# EAGLE schematic Column_PCB_Schematic (EAGLE 7.5.0), part 1 of 3
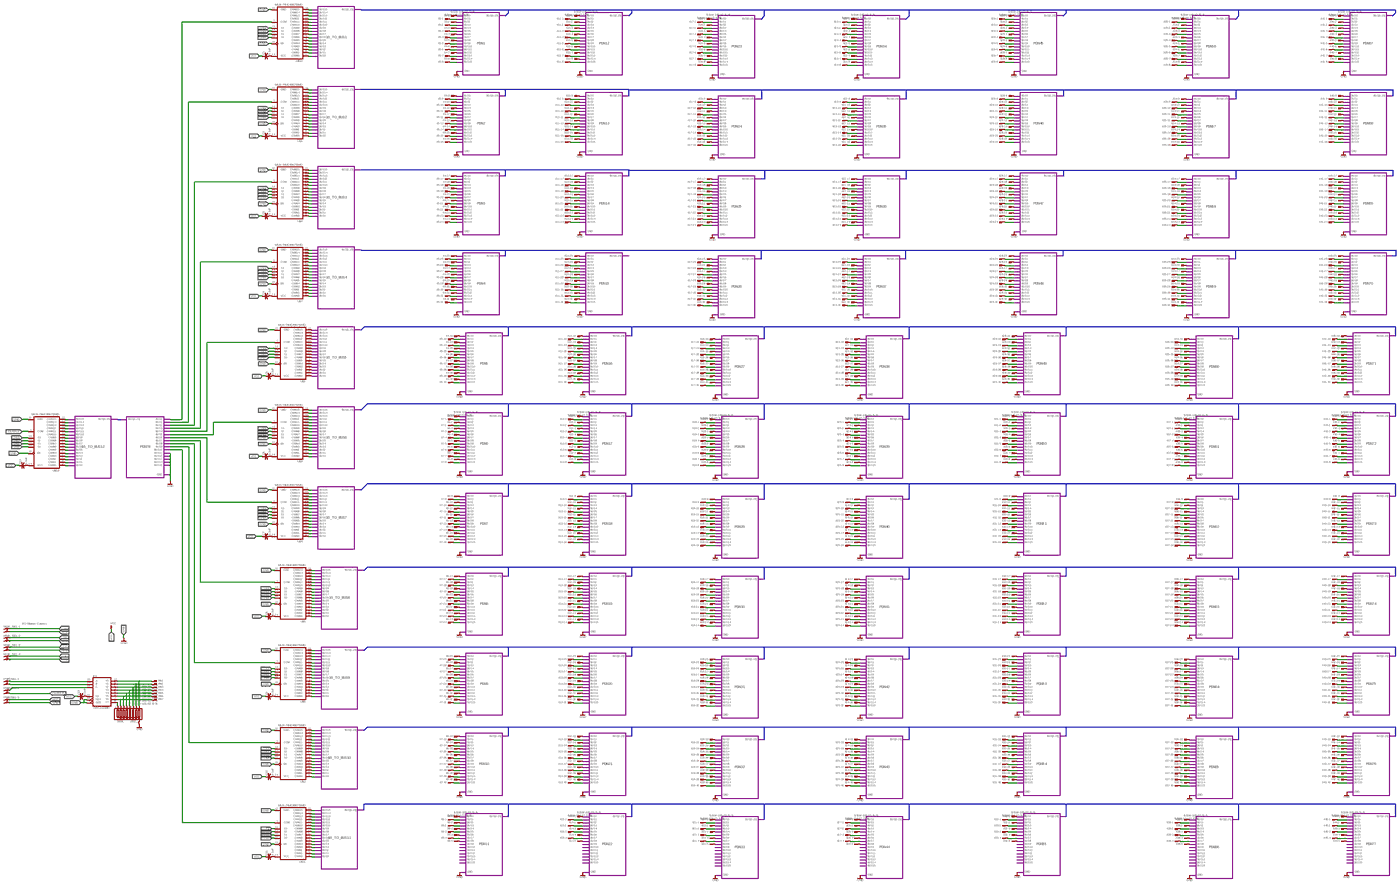
[diagram p0: schematic, sheet 1, overview]
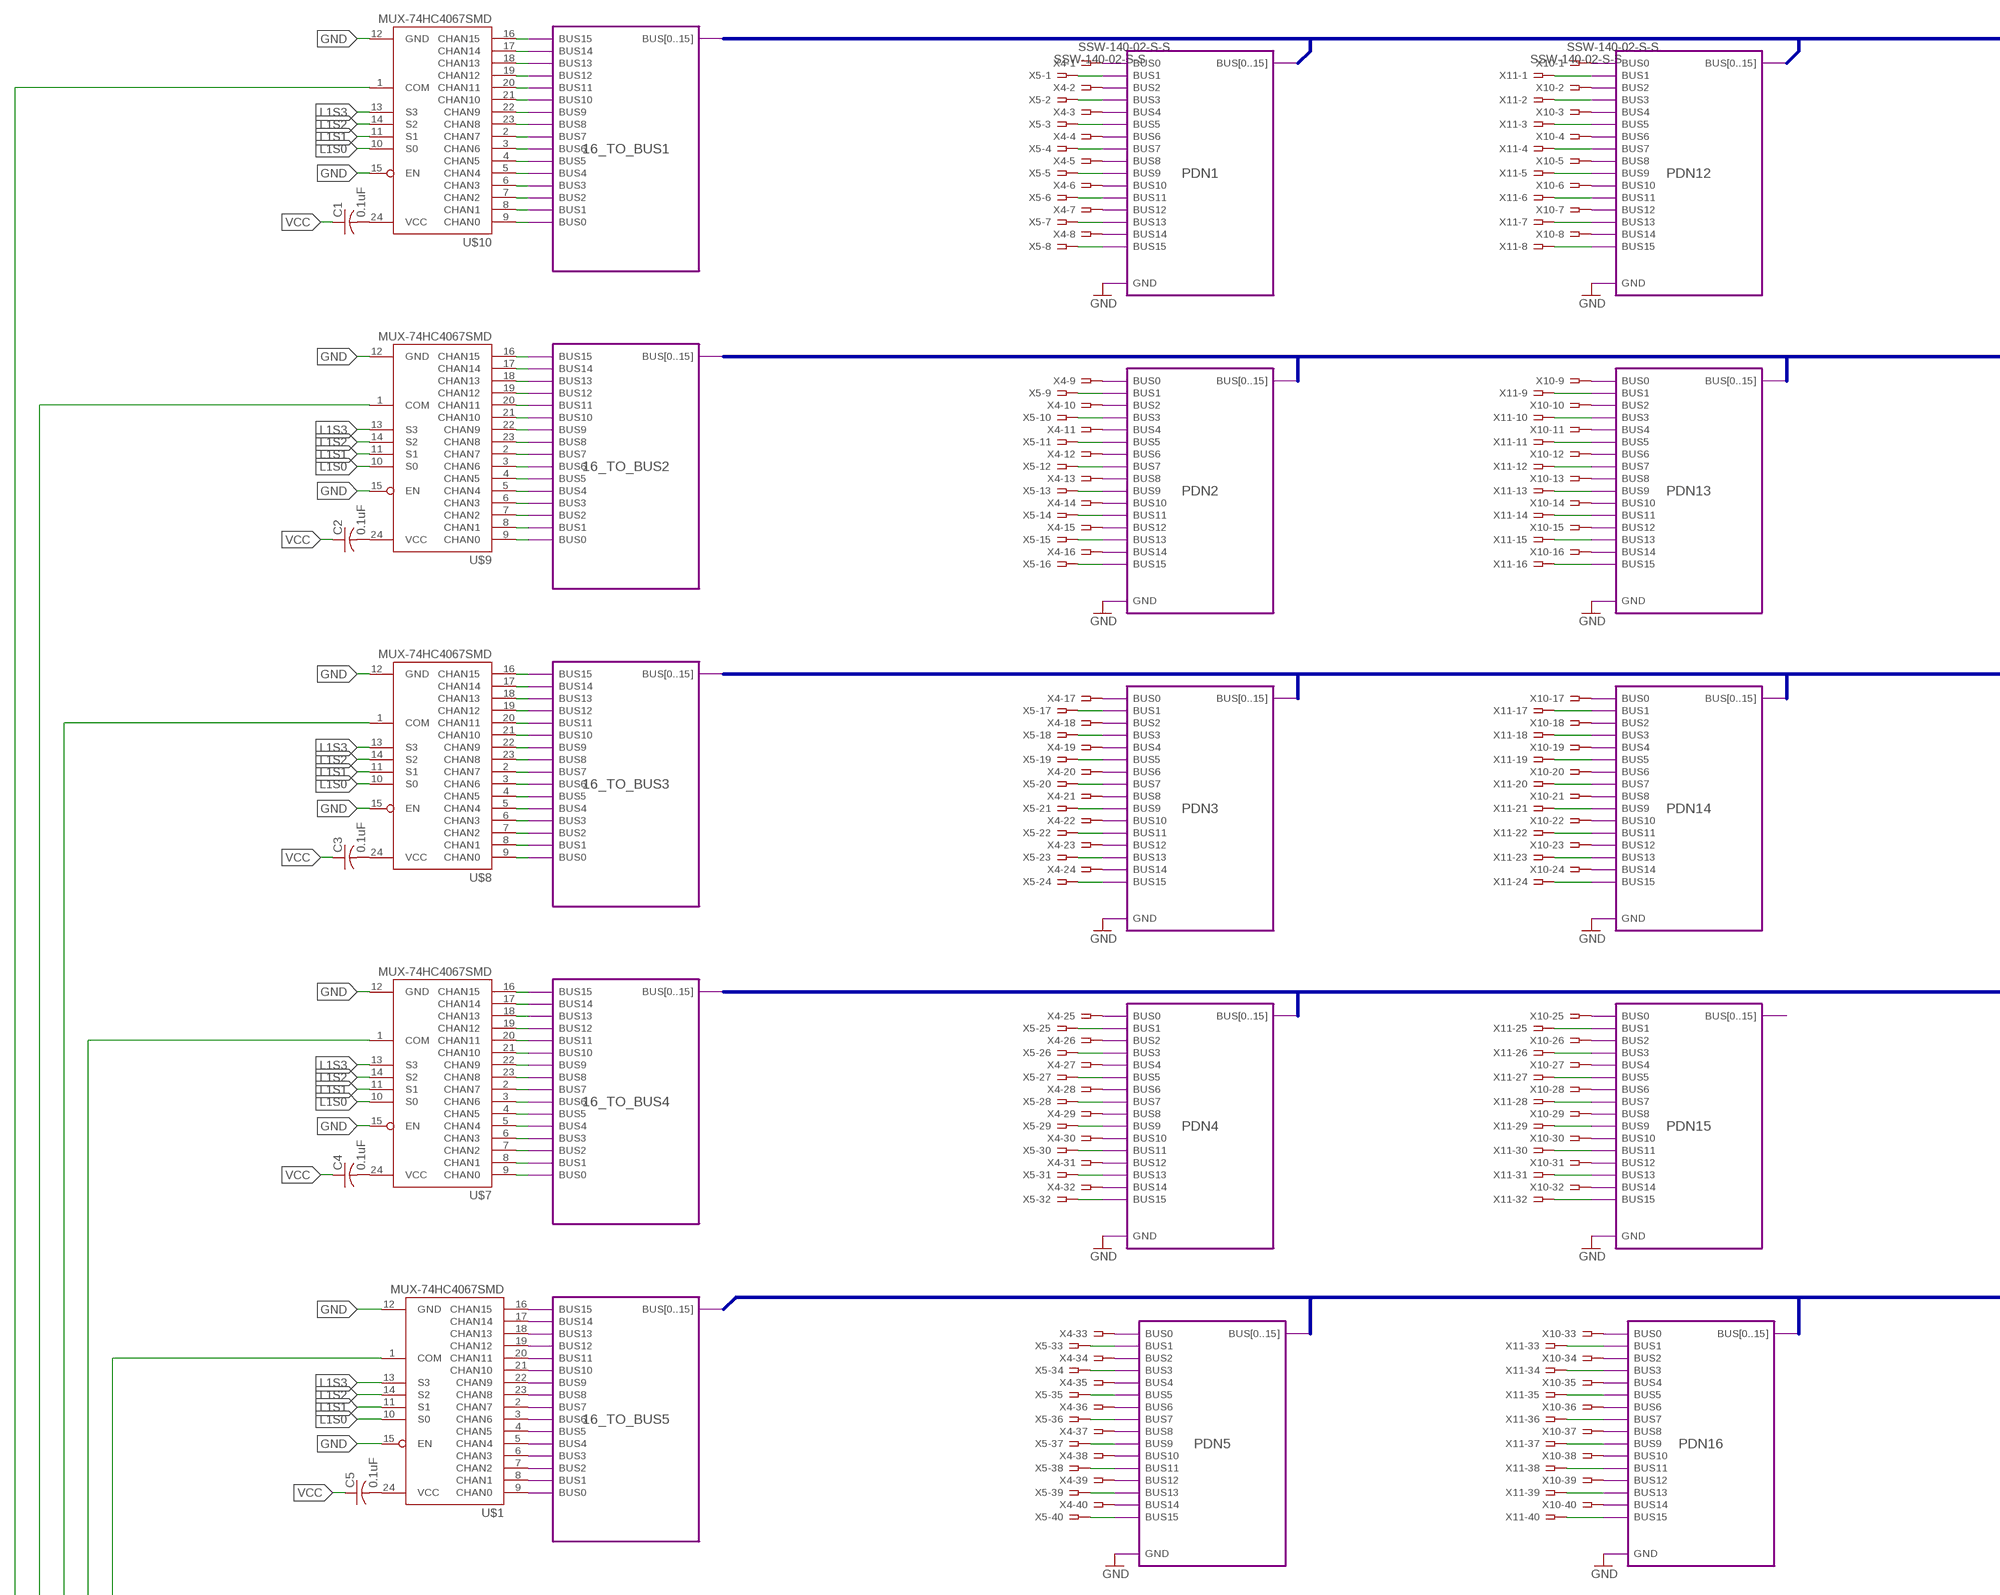
[diagram p1: schematic, sheet 1, part 1 of 7]
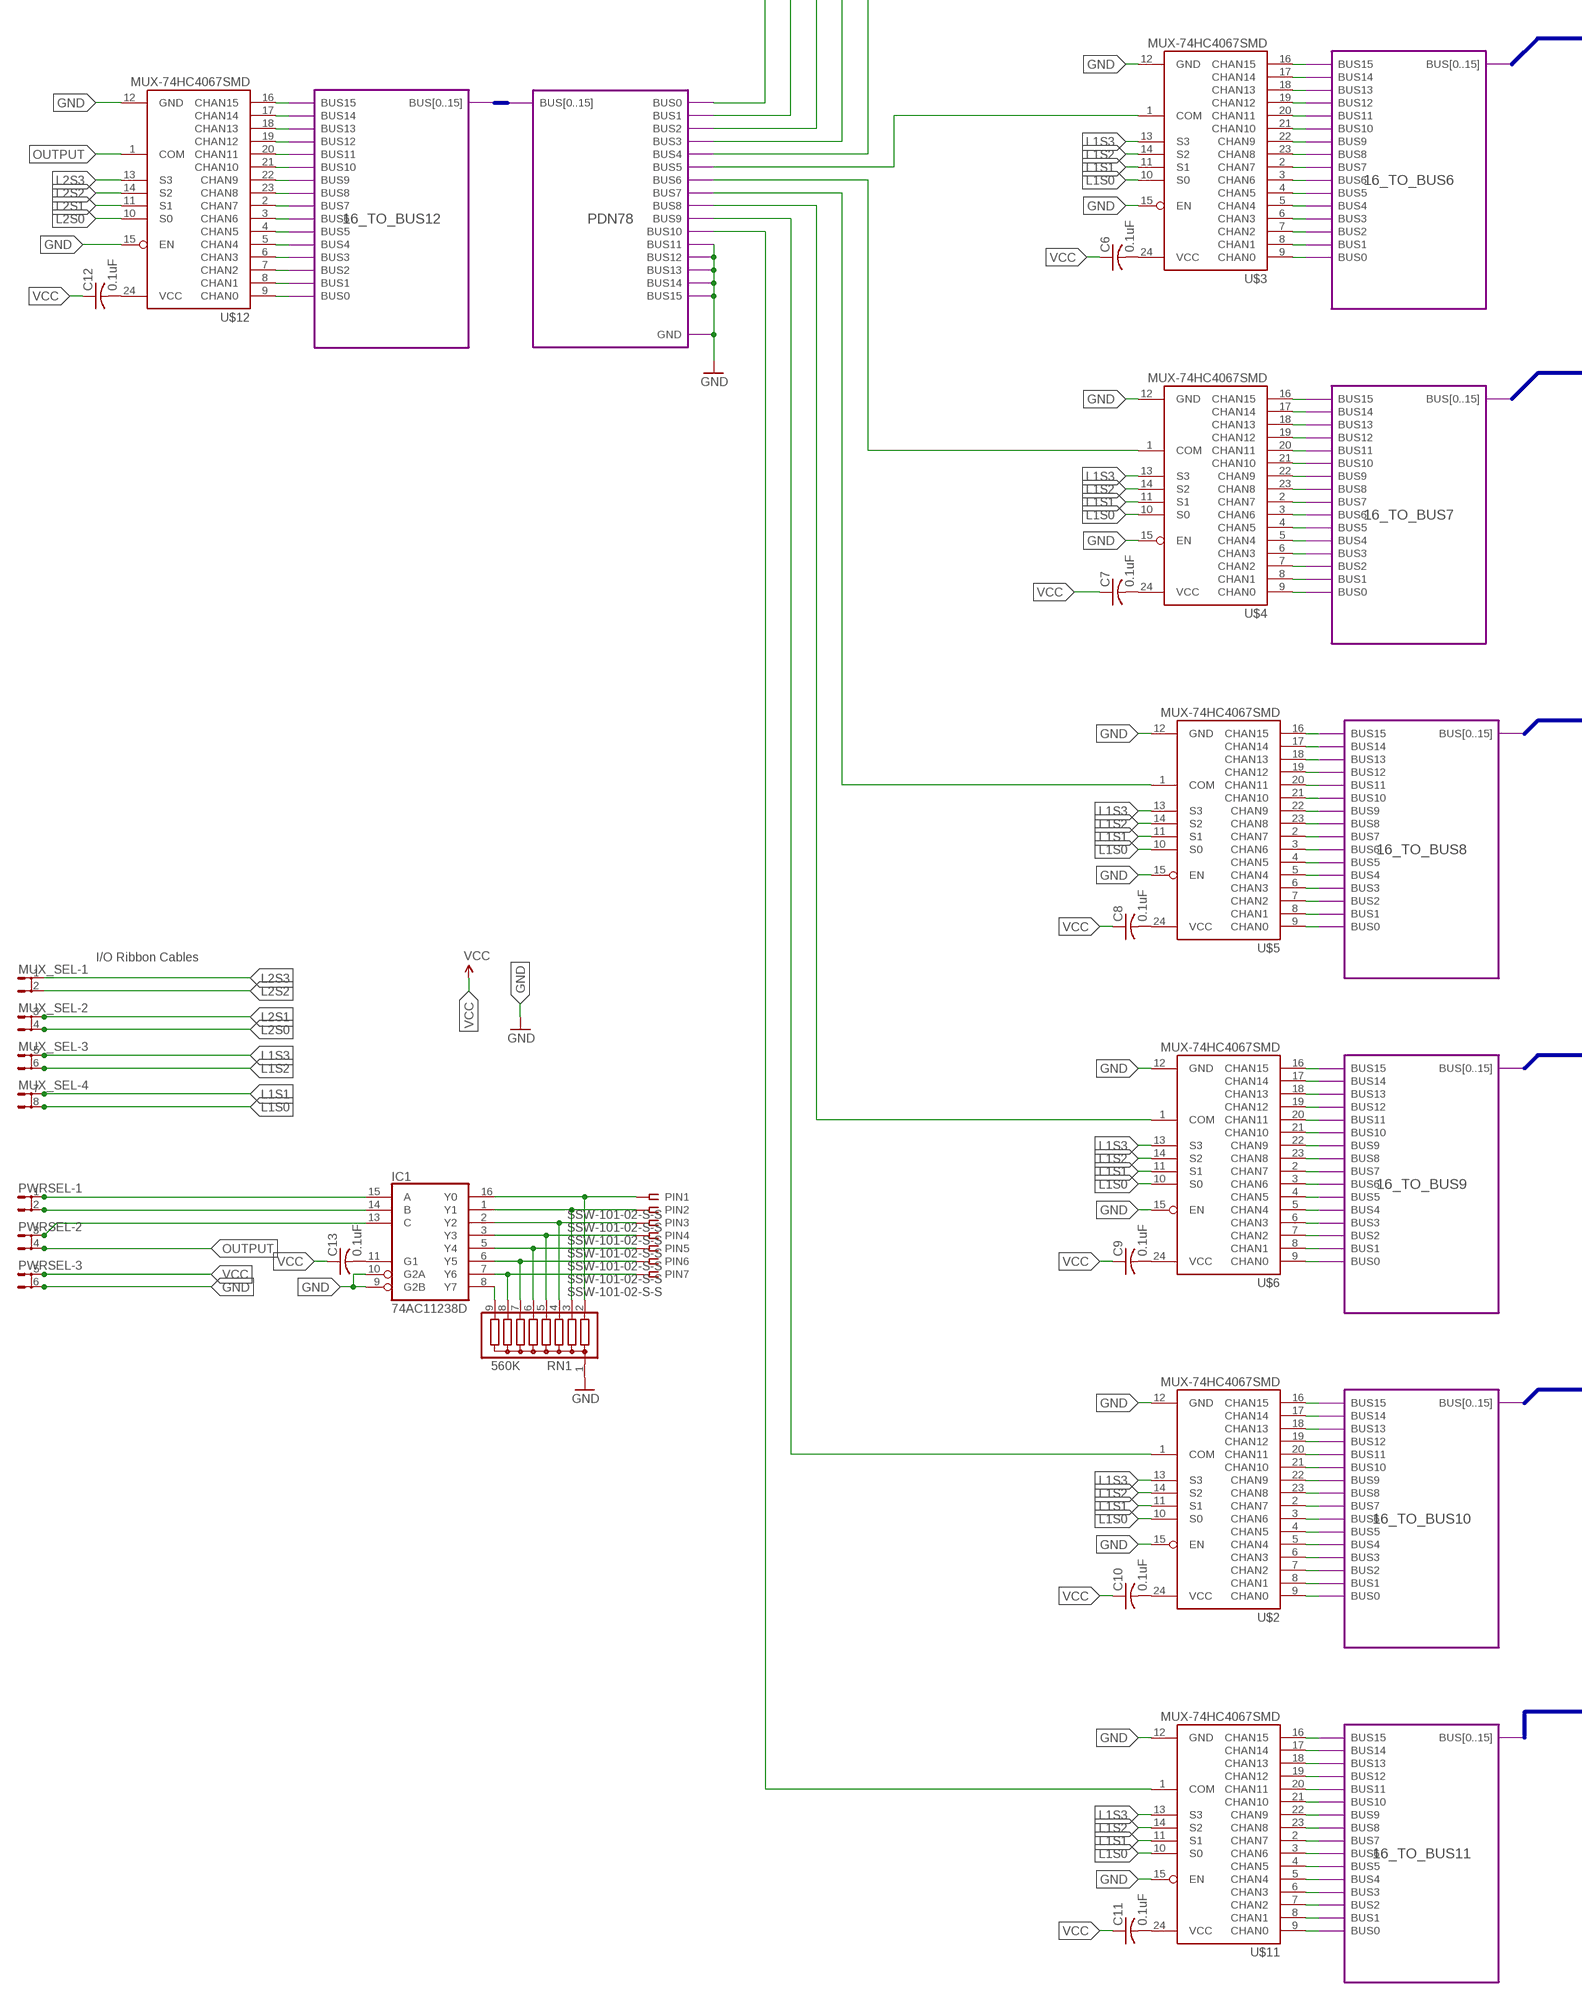
[diagram p2: schematic, sheet 1, part 2 of 7]
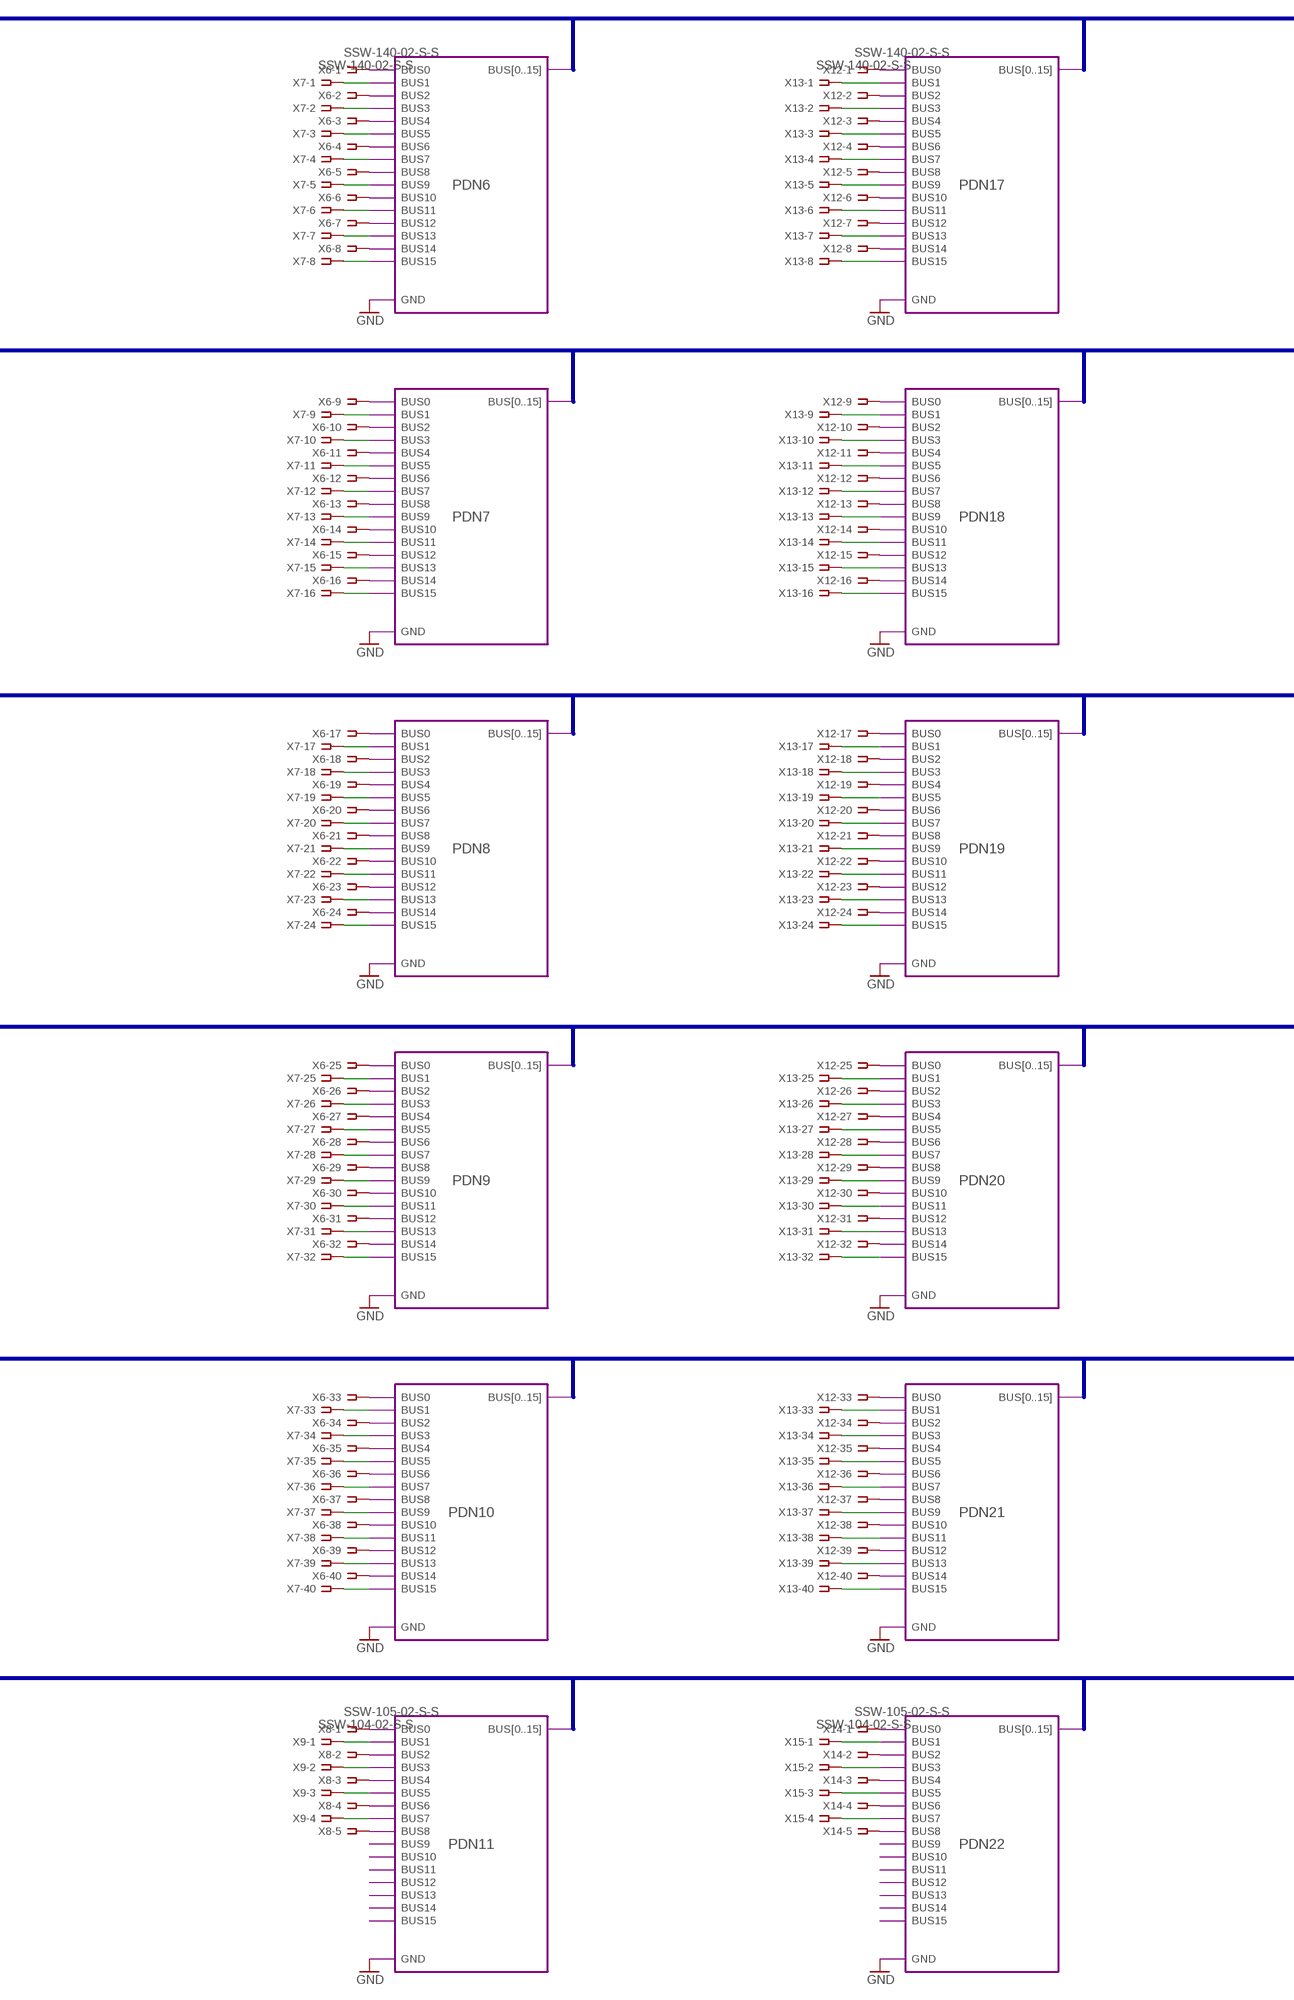
[diagram p3: schematic, sheet 1, part 3 of 7]
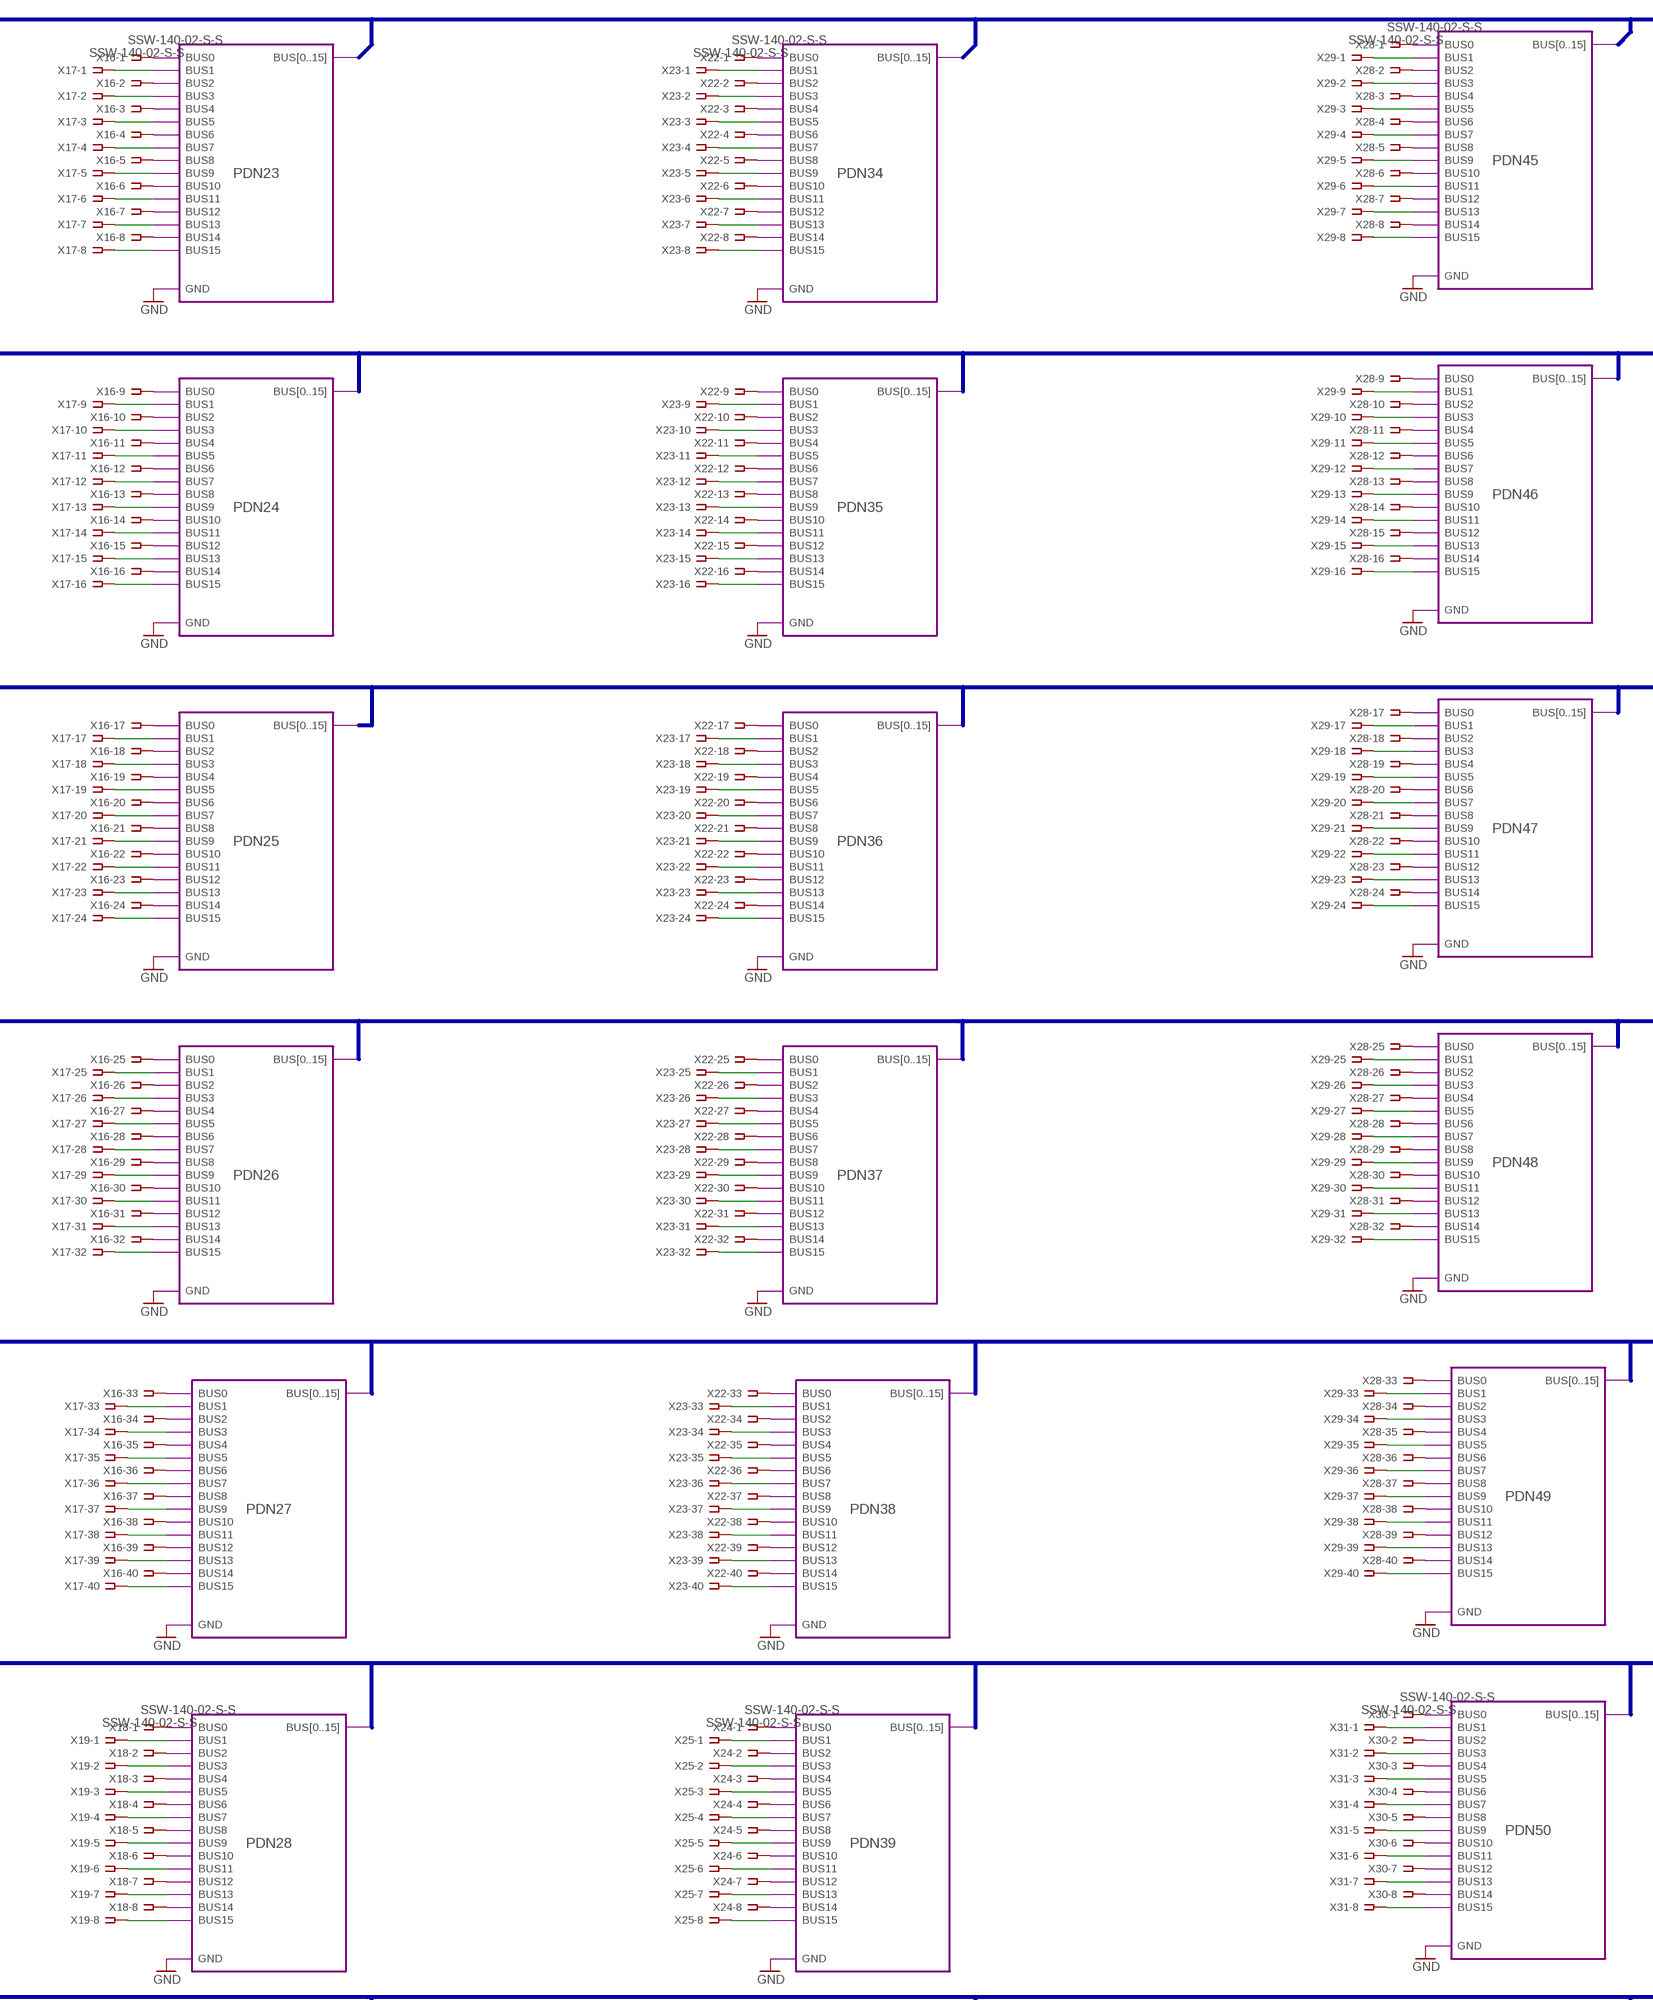
[diagram p4: schematic, sheet 1, part 4 of 7]
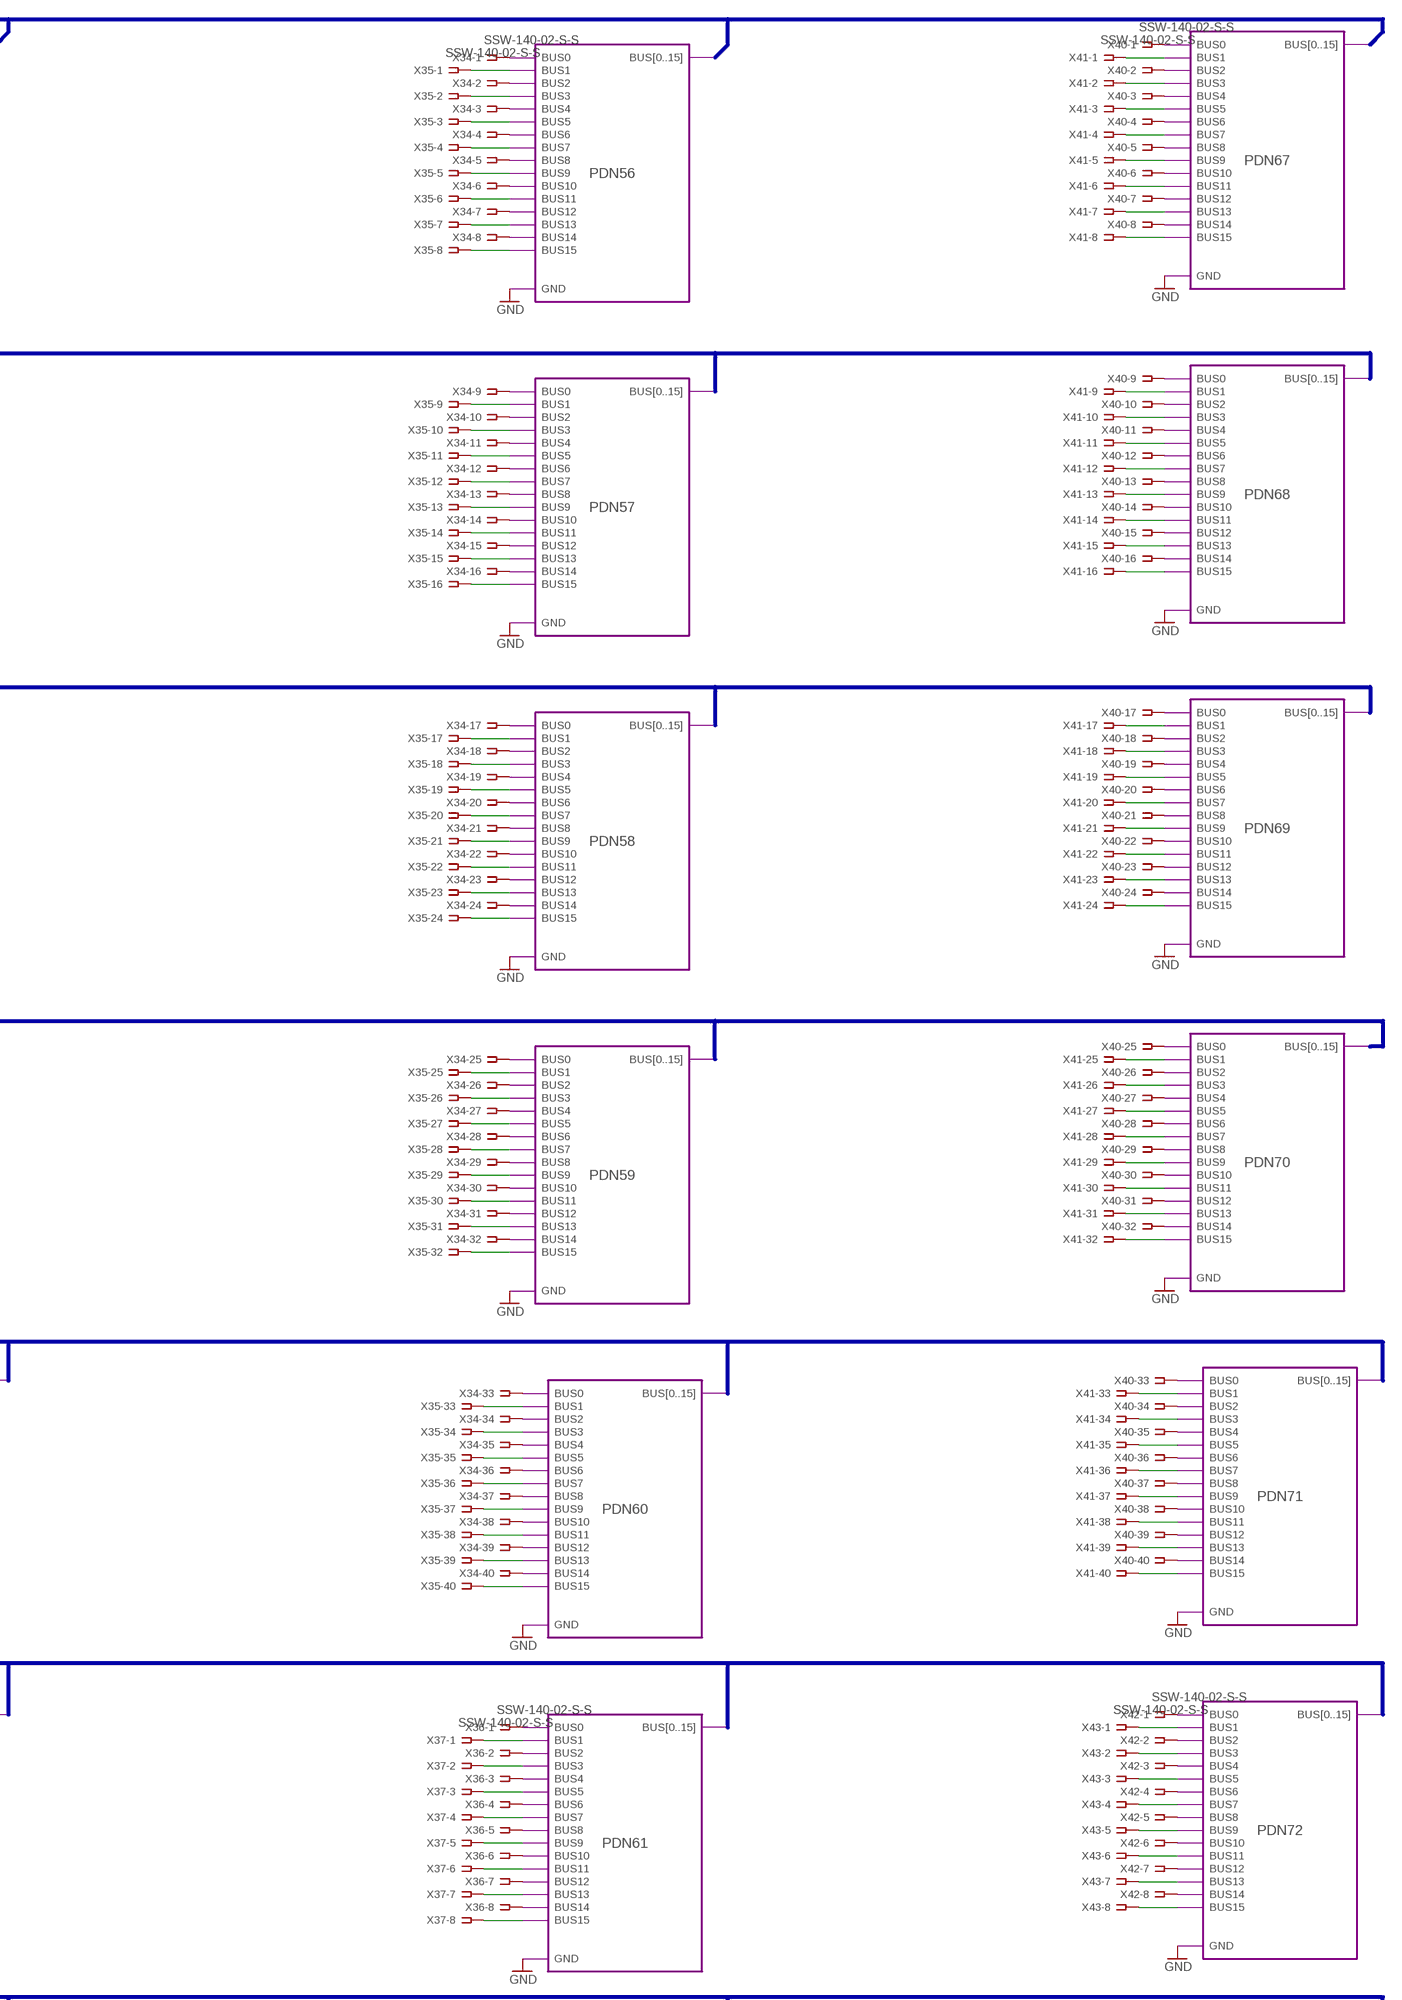
[diagram p5: schematic, sheet 1, part 5 of 7]
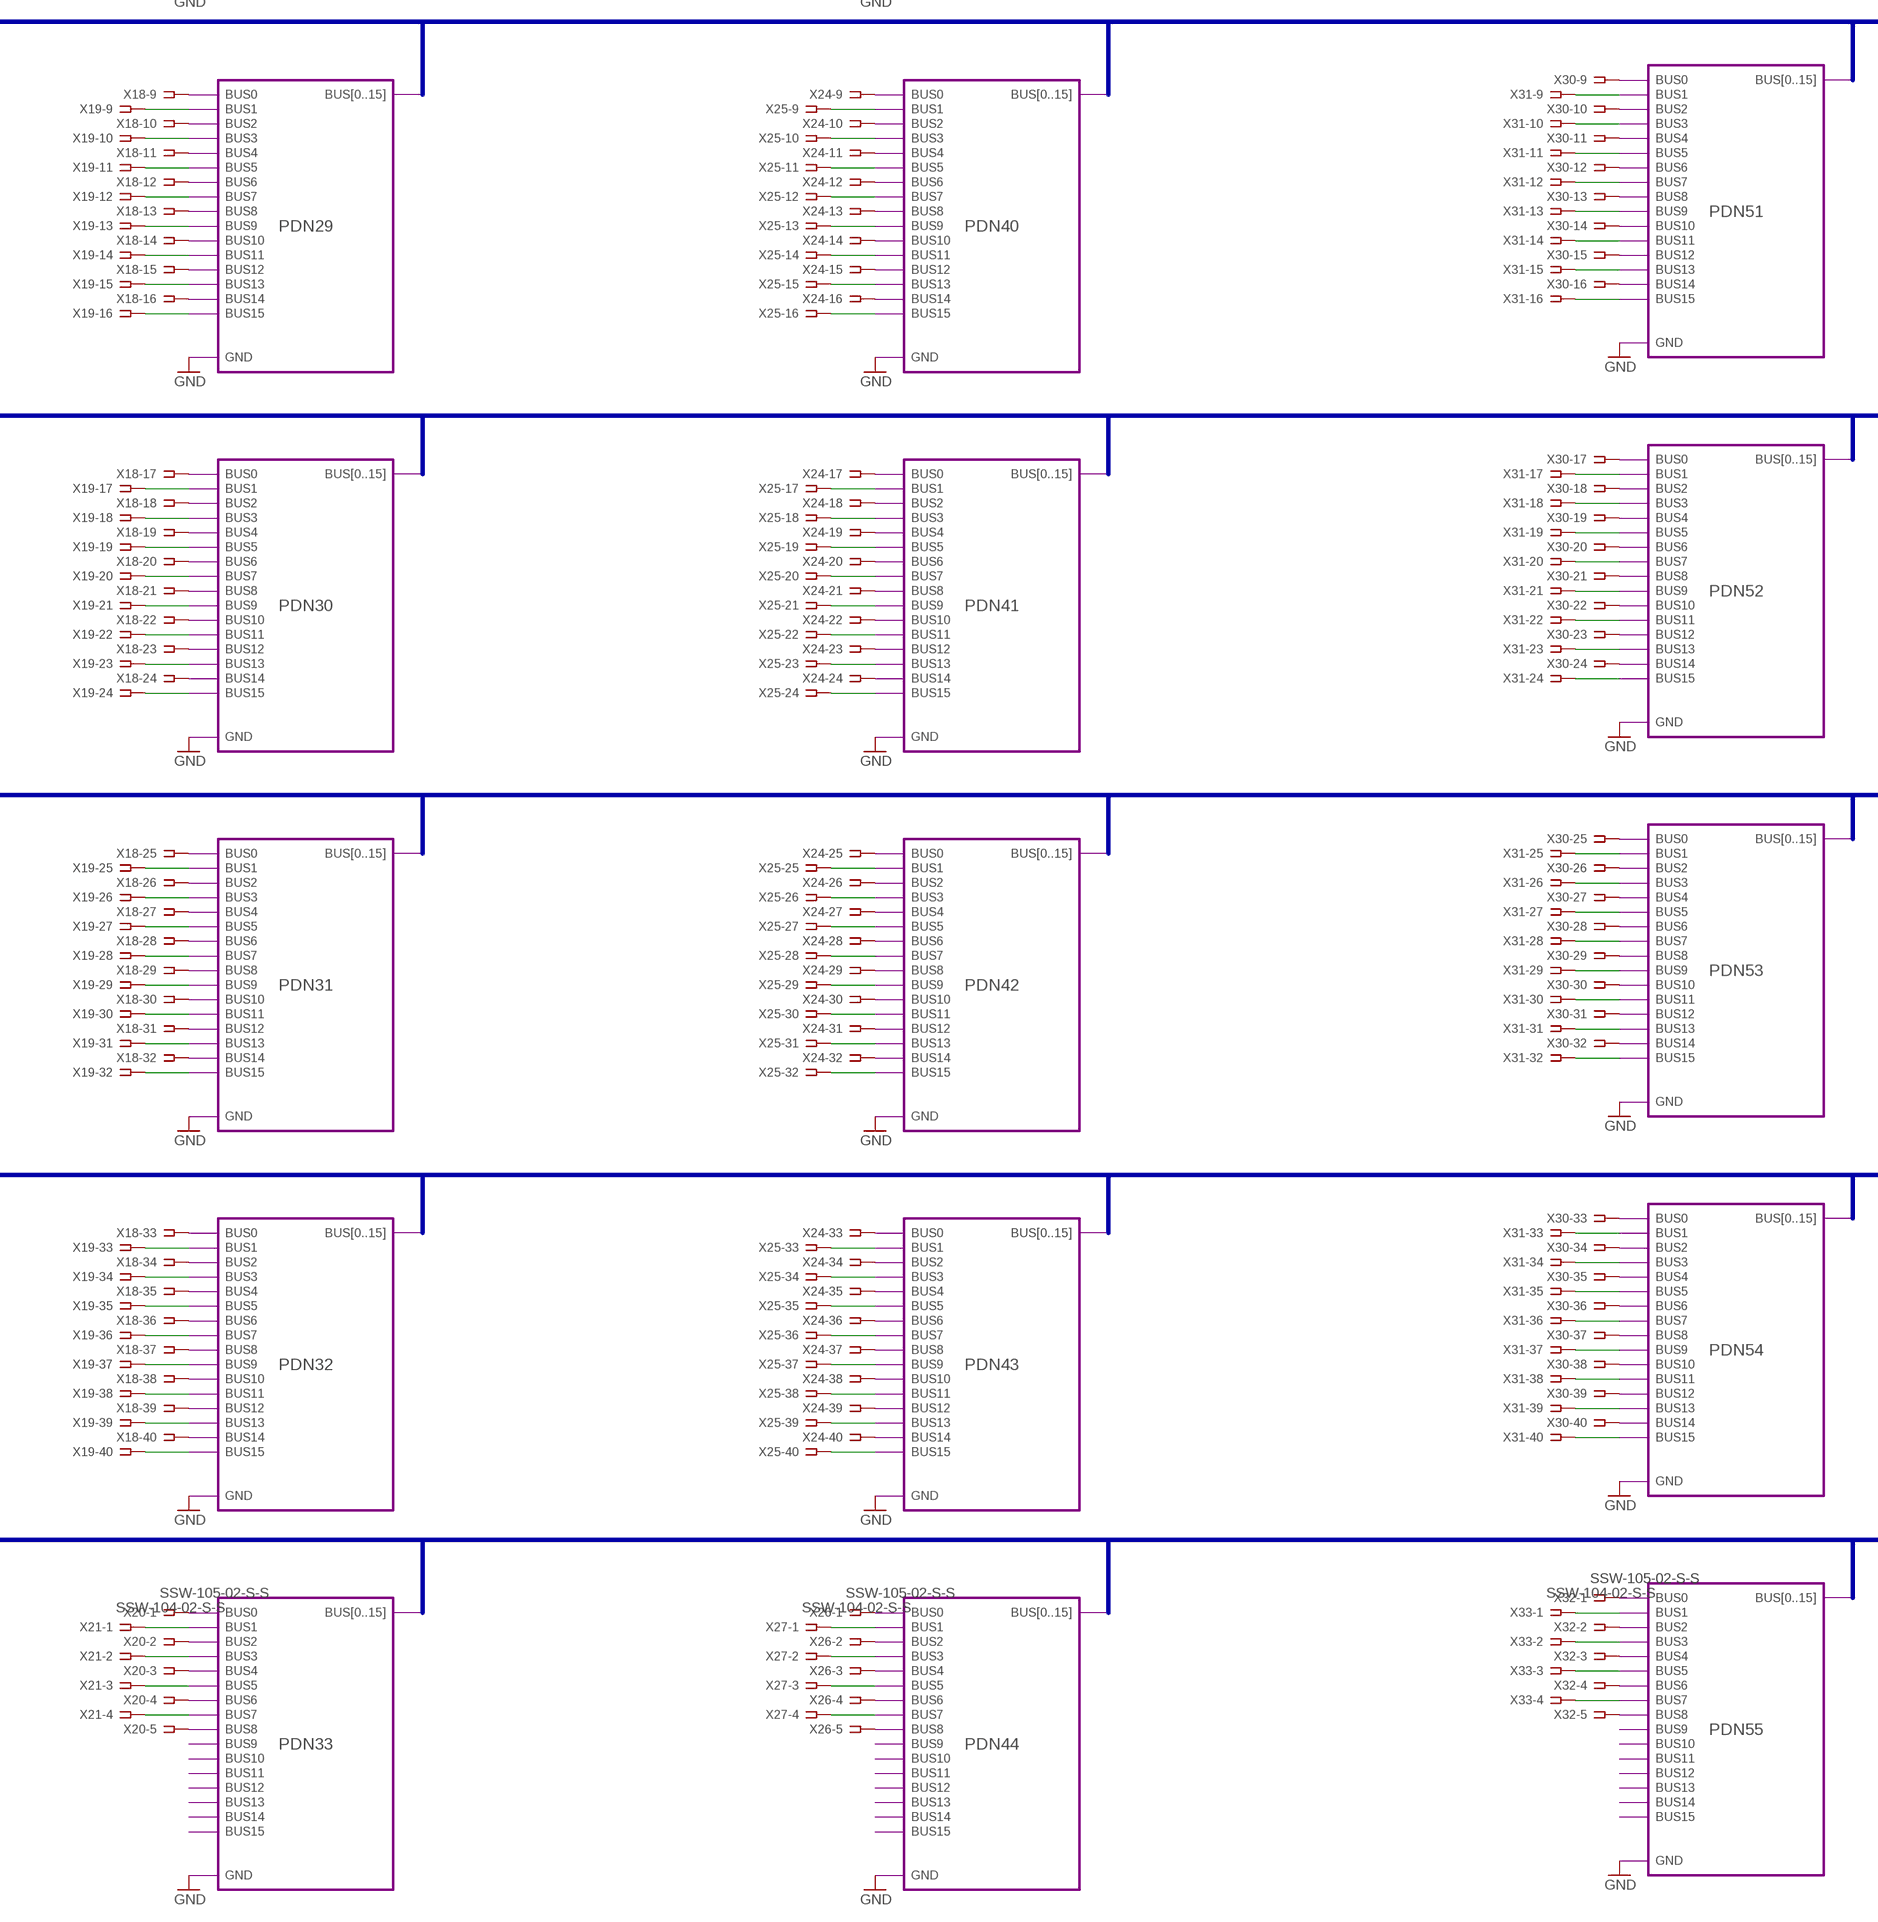
[diagram p6: schematic, sheet 1, part 6 of 7]
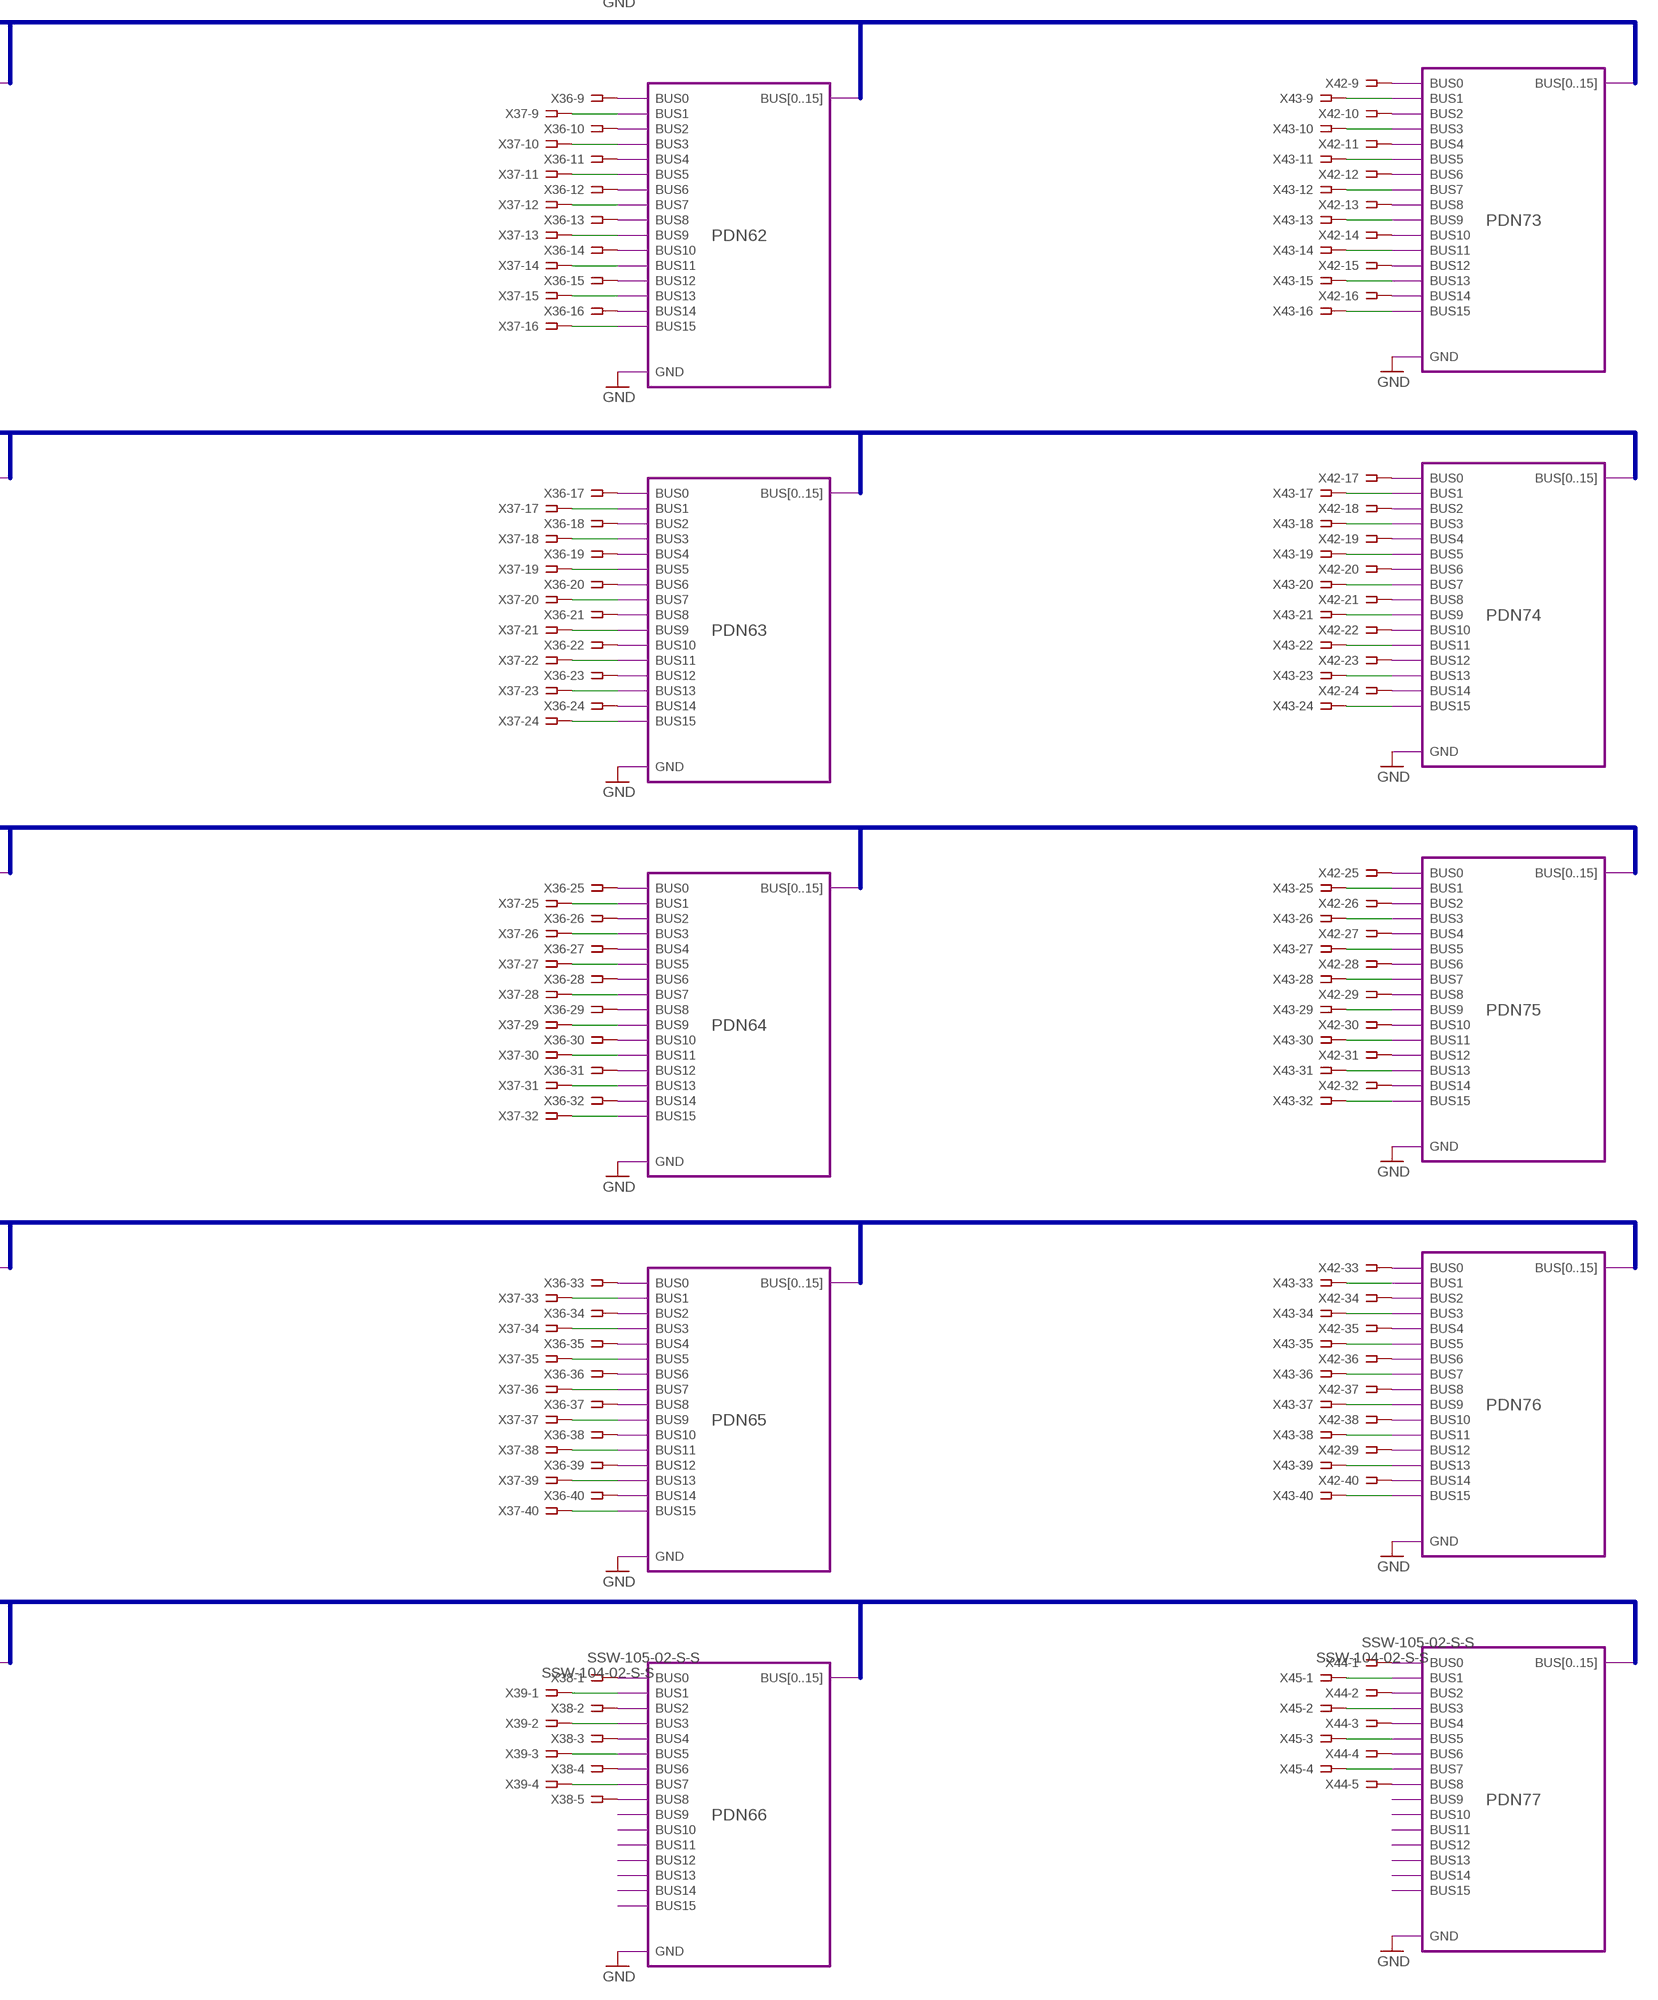
[diagram p7: schematic, sheet 1, part 7 of 7]

## Parts
C1  0.1uF  C-USC0402  [C0402]
C2  0.1uF  C-USC0402  [C0402]
C3  0.1uF  C-USC0402  [C0402]
C4  0.1uF  C-USC0402  [C0402]
C5  0.1uF  C-USC0402  [C0402]
C6  0.1uF  C-USC0402  [C0402]
C7  0.1uF  C-USC0402  [C0402]
C8  0.1uF  C-USC0402  [C0402]
C9  0.1uF  C-USC0402  [C0402]
C10  0.1uF  C-USC0402  [C0402]
C11  0.1uF  C-USC0402  [C0402]
C12  0.1uF  C-USC0402  [C0402]
C13  0.1uF  C-USC0402  [C0402]
IC1  74AC11238D  [SO16]
MUX_SEL  SH5-4  [SH5-4]
PIN1  SSW-101-02-S-S  [SSW-101-02-S-S]
PIN2  SSW-101-02-S-S  [SSW-101-02-S-S]
PIN3  SSW-101-02-S-S  [SSW-101-02-S-S]
PIN4  SSW-101-02-S-S  [SSW-101-02-S-S]
PIN5  SSW-101-02-S-S  [SSW-101-02-S-S]
PIN6  SSW-101-02-S-S  [SSW-101-02-S-S]
PIN7  SSW-101-02-S-S  [SSW-101-02-S-S]
PWRSEL  SH5-3  [SH5-3]
RN1  560K  G08R  [SIL9]
U$1  MUX-74HC4067SMD  [SSOP24]
U$2  MUX-74HC4067SMD  [SSOP24]
U$3  MUX-74HC4067SMD  [SSOP24]
U$4  MUX-74HC4067SMD  [SSOP24]
U$5  MUX-74HC4067SMD  [SSOP24]
U$6  MUX-74HC4067SMD  [SSOP24]
U$7  MUX-74HC4067SMD  [SSOP24]
U$8  MUX-74HC4067SMD  [SSOP24]
U$9  MUX-74HC4067SMD  [SSOP24]
U$10  MUX-74HC4067SMD  [SSOP24]
U$11  MUX-74HC4067SMD  [SSOP24]
U$12  MUX-74HC4067SMD  [SSOP24]
X4  SSW-140-02-S-S  [SSW-140-02-S-S]
X5  SSW-140-02-S-S  [SSW-140-02-S-S]
X6  SSW-140-02-S-S  [SSW-140-02-S-S]
X7  SSW-140-02-S-S  [SSW-140-02-S-S]
X8  SSW-105-02-S-S  [SSW-105-02-S-S]
X9  SSW-104-02-S-S  [SSW-104-02-S-S]
X10  SSW-140-02-S-S  [SSW-140-02-S-S]
X11  SSW-140-02-S-S  [SSW-140-02-S-S]
X12  SSW-140-02-S-S  [SSW-140-02-S-S]
X13  SSW-140-02-S-S  [SSW-140-02-S-S]
X14  SSW-105-02-S-S  [SSW-105-02-S-S]
X15  SSW-104-02-S-S  [SSW-104-02-S-S]
X16  SSW-140-02-S-S  [SSW-140-02-S-S]
X17  SSW-140-02-S-S  [SSW-140-02-S-S]
X18  SSW-140-02-S-S  [SSW-140-02-S-S]
X19  SSW-140-02-S-S  [SSW-140-02-S-S]
X20  SSW-105-02-S-S  [SSW-105-02-S-S]
X21  SSW-104-02-S-S  [SSW-104-02-S-S]
X22  SSW-140-02-S-S  [SSW-140-02-S-S]
X23  SSW-140-02-S-S  [SSW-140-02-S-S]
X24  SSW-140-02-S-S  [SSW-140-02-S-S]
X25  SSW-140-02-S-S  [SSW-140-02-S-S]
X26  SSW-105-02-S-S  [SSW-105-02-S-S]
X27  SSW-104-02-S-S  [SSW-104-02-S-S]
X28  SSW-140-02-S-S  [SSW-140-02-S-S]
X29  SSW-140-02-S-S  [SSW-140-02-S-S]
X30  SSW-140-02-S-S  [SSW-140-02-S-S]
X31  SSW-140-02-S-S  [SSW-140-02-S-S]
X32  SSW-105-02-S-S  [SSW-105-02-S-S]
X33  SSW-104-02-S-S  [SSW-104-02-S-S]
X34  SSW-140-02-S-S  [SSW-140-02-S-S]
X35  SSW-140-02-S-S  [SSW-140-02-S-S]
X36  SSW-140-02-S-S  [SSW-140-02-S-S]
X37  SSW-140-02-S-S  [SSW-140-02-S-S]
X38  SSW-105-02-S-S  [SSW-105-02-S-S]
X39  SSW-104-02-S-S  [SSW-104-02-S-S]
X40  SSW-140-02-S-S  [SSW-140-02-S-S]
X41  SSW-140-02-S-S  [SSW-140-02-S-S]
X42  SSW-140-02-S-S  [SSW-140-02-S-S]
X43  SSW-140-02-S-S  [SSW-140-02-S-S]
X44  SSW-105-02-S-S  [SSW-105-02-S-S]
X45  SSW-104-02-S-S  [SSW-104-02-S-S]

## Module instances
PDN1 = MUX_PULLDOWN_16_TO_BUS
PDN2 = MUX_PULLDOWN_16_TO_BUS
PDN3 = MUX_PULLDOWN_16_TO_BUS
PDN4 = MUX_PULLDOWN_16_TO_BUS
PDN5 = MUX_PULLDOWN_16_TO_BUS
PDN6 = MUX_PULLDOWN_16_TO_BUS
PDN7 = MUX_PULLDOWN_16_TO_BUS
PDN8 = MUX_PULLDOWN_16_TO_BUS
PDN9 = MUX_PULLDOWN_16_TO_BUS
PDN10 = MUX_PULLDOWN_16_TO_BUS
PDN11 = MUX_PULLDOWN_16_TO_BUS
PDN12 = MUX_PULLDOWN_16_TO_BUS
PDN13 = MUX_PULLDOWN_16_TO_BUS
PDN14 = MUX_PULLDOWN_16_TO_BUS
PDN15 = MUX_PULLDOWN_16_TO_BUS
PDN16 = MUX_PULLDOWN_16_TO_BUS
PDN17 = MUX_PULLDOWN_16_TO_BUS
PDN18 = MUX_PULLDOWN_16_TO_BUS
PDN19 = MUX_PULLDOWN_16_TO_BUS
PDN20 = MUX_PULLDOWN_16_TO_BUS
PDN21 = MUX_PULLDOWN_16_TO_BUS
PDN22 = MUX_PULLDOWN_16_TO_BUS
PDN23 = MUX_PULLDOWN_16_TO_BUS
PDN24 = MUX_PULLDOWN_16_TO_BUS
PDN25 = MUX_PULLDOWN_16_TO_BUS
PDN26 = MUX_PULLDOWN_16_TO_BUS
PDN27 = MUX_PULLDOWN_16_TO_BUS
PDN28 = MUX_PULLDOWN_16_TO_BUS
PDN29 = MUX_PULLDOWN_16_TO_BUS
PDN30 = MUX_PULLDOWN_16_TO_BUS
PDN31 = MUX_PULLDOWN_16_TO_BUS
PDN32 = MUX_PULLDOWN_16_TO_BUS
PDN33 = MUX_PULLDOWN_16_TO_BUS
PDN34 = MUX_PULLDOWN_16_TO_BUS
PDN35 = MUX_PULLDOWN_16_TO_BUS
PDN36 = MUX_PULLDOWN_16_TO_BUS
PDN37 = MUX_PULLDOWN_16_TO_BUS
PDN38 = MUX_PULLDOWN_16_TO_BUS
PDN39 = MUX_PULLDOWN_16_TO_BUS
PDN40 = MUX_PULLDOWN_16_TO_BUS
PDN41 = MUX_PULLDOWN_16_TO_BUS
PDN42 = MUX_PULLDOWN_16_TO_BUS
PDN43 = MUX_PULLDOWN_16_TO_BUS
PDN44 = MUX_PULLDOWN_16_TO_BUS
PDN45 = MUX_PULLDOWN_16_TO_BUS
PDN46 = MUX_PULLDOWN_16_TO_BUS
PDN47 = MUX_PULLDOWN_16_TO_BUS
PDN48 = MUX_PULLDOWN_16_TO_BUS
PDN49 = MUX_PULLDOWN_16_TO_BUS
PDN50 = MUX_PULLDOWN_16_TO_BUS
PDN51 = MUX_PULLDOWN_16_TO_BUS
PDN52 = MUX_PULLDOWN_16_TO_BUS
PDN53 = MUX_PULLDOWN_16_TO_BUS
PDN54 = MUX_PULLDOWN_16_TO_BUS
PDN55 = MUX_PULLDOWN_16_TO_BUS
PDN56 = MUX_PULLDOWN_16_TO_BUS
PDN57 = MUX_PULLDOWN_16_TO_BUS
PDN58 = MUX_PULLDOWN_16_TO_BUS
PDN59 = MUX_PULLDOWN_16_TO_BUS
PDN60 = MUX_PULLDOWN_16_TO_BUS
PDN61 = MUX_PULLDOWN_16_TO_BUS
PDN62 = MUX_PULLDOWN_16_TO_BUS
PDN63 = MUX_PULLDOWN_16_TO_BUS
PDN64 = MUX_PULLDOWN_16_TO_BUS
PDN65 = MUX_PULLDOWN_16_TO_BUS
PDN66 = MUX_PULLDOWN_16_TO_BUS
PDN67 = MUX_PULLDOWN_16_TO_BUS
PDN68 = MUX_PULLDOWN_16_TO_BUS
PDN69 = MUX_PULLDOWN_16_TO_BUS
PDN70 = MUX_PULLDOWN_16_TO_BUS
PDN71 = MUX_PULLDOWN_16_TO_BUS
PDN72 = MUX_PULLDOWN_16_TO_BUS
PDN73 = MUX_PULLDOWN_16_TO_BUS
PDN74 = MUX_PULLDOWN_16_TO_BUS
PDN75 = MUX_PULLDOWN_16_TO_BUS
PDN76 = MUX_PULLDOWN_16_TO_BUS
PDN77 = MUX_PULLDOWN_16_TO_BUS
16_TO_BUS1 = 16_TO_BUS
16_TO_BUS2 = 16_TO_BUS
16_TO_BUS3 = 16_TO_BUS
16_TO_BUS4 = 16_TO_BUS
16_TO_BUS5 = 16_TO_BUS
16_TO_BUS6 = 16_TO_BUS
16_TO_BUS7 = 16_TO_BUS
16_TO_BUS8 = 16_TO_BUS
16_TO_BUS9 = 16_TO_BUS
16_TO_BUS10 = 16_TO_BUS
16_TO_BUS11 = 16_TO_BUS
PDN78 = MUX_PULLDOWN_16_TO_BUS
16_TO_BUS12 = 16_TO_BUS